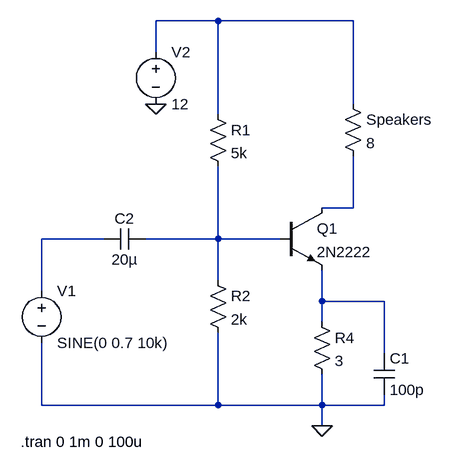
[diagram p0: schematic Class-A.asc]
Class-A.asc, the LTspice schematic file:
Version 4
SHEET 1 880 680
WIRE 64 -160 -32 -160
WIRE 272 -160 64 -160
WIRE -32 -112 -32 -160
WIRE 272 -32 272 -160
WIRE 64 -16 64 -160
WIRE 272 128 272 48
WIRE 272 128 224 128
WIRE -112 176 -208 176
WIRE 64 176 64 64
WIRE 64 176 -48 176
WIRE 160 176 64 176
WIRE 64 240 64 176
WIRE -208 256 -208 176
WIRE 224 272 224 224
WIRE 320 272 224 272
WIRE 224 304 224 272
WIRE 320 352 320 272
WIRE -208 432 -208 336
WIRE 64 432 64 320
WIRE 64 432 -208 432
WIRE 224 432 224 384
WIRE 224 432 64 432
WIRE 320 432 320 416
WIRE 320 432 224 432
WIRE 224 464 224 432
FLAG 224 464 0
FLAG -32 -32 0
SYMBOL res 48 -32 R0
SYMATTR InstName R1
SYMATTR Value 5k
SYMBOL res 48 224 R0
SYMATTR InstName R2
SYMATTR Value 2k
SYMBOL res 208 288 R0
SYMATTR InstName R4
SYMATTR Value 3
SYMBOL cap 304 352 R0
SYMATTR InstName C1
SYMATTR Value 100p
SYMBOL voltage -32 -128 R0
WINDOW 123 0 0 Left 0
WINDOW 39 0 0 Left 0
SYMATTR InstName V2
SYMATTR Value 12
SYMBOL cap -48 160 R90
WINDOW 0 0 32 VBottom 2
WINDOW 3 32 32 VTop 2
SYMATTR InstName C2
SYMATTR Value 20µ
SYMBOL voltage -208 240 R0
WINDOW 123 0 0 Left 0
WINDOW 39 0 0 Left 0
SYMATTR InstName V1
SYMATTR Value SINE(0 0.7 10k)
SYMBOL npn3 160 128 R0
SYMATTR InstName Q1
SYMATTR Value 2N2222
SYMBOL res 256 -48 R0
SYMATTR InstName Speakers
SYMATTR Value 8
TEXT -240 488 Left 2 !.tran 0 1m 0 100u

The netlist it stands for:
* Class-A.asc
R1 N001 N004 5k
R2 N004 0 2k
R4 N005 0 3
C1 N005 0 100p
V2 N001 0 12
C2 N004 N003 20µ
V1 N003 0 SINE(0 0.7 10k)
Q1 N002 N004 N005 0 2N2222
R§Speakers N001 N002 8
.model NPN NPN
.model PNP PNP
.lib standard.bjt
.tran 0 1m 0 100u
.backanno
.end